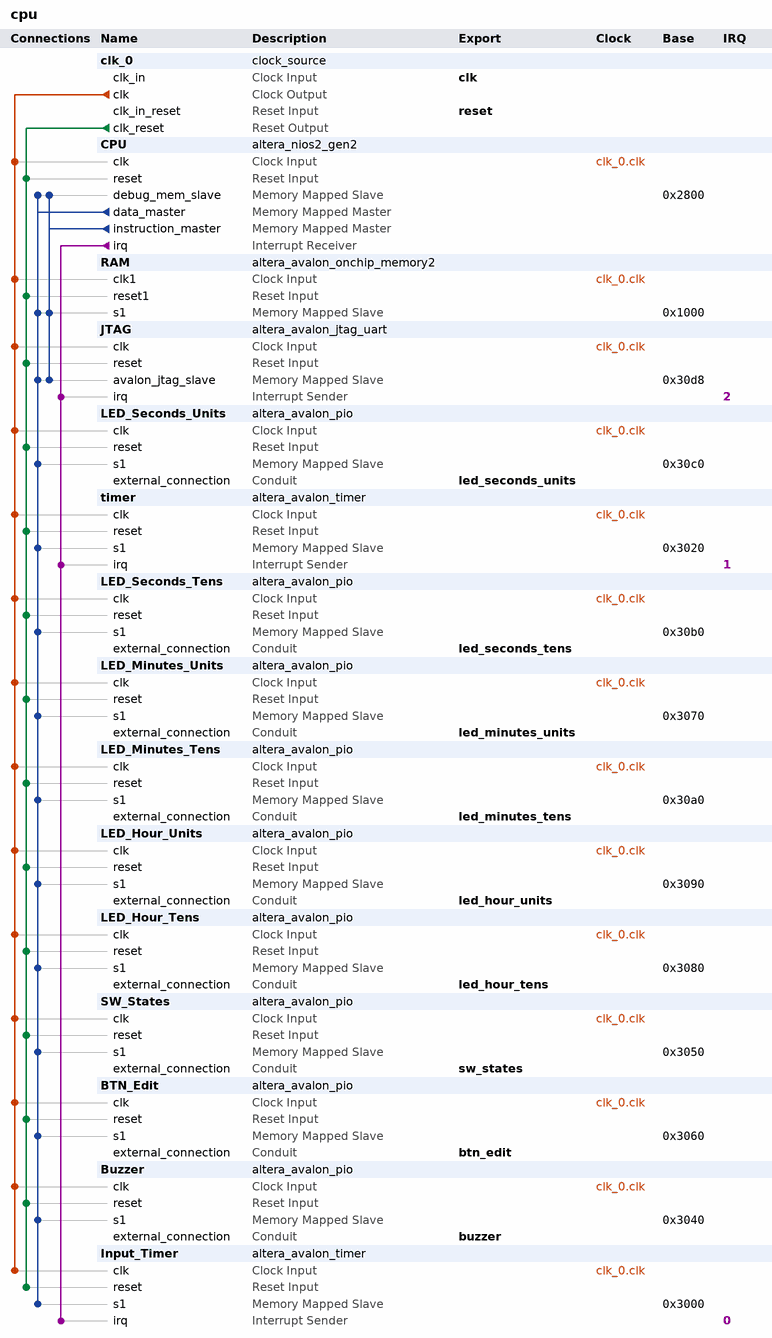
[diagram p0: system contents]
# Platform Designer (Qsys) system cpu, Cyclone V 5CSEMA5F31C6
# Parameters at their usual value, and those the tool derives, are not listed.
package require -exact qsys 18.1
create_system cpu
set_project_property DEVICE_FAMILY {Cyclone V}
set_project_property DEVICE 5CSEMA5F31C6

add_instance clk_0 clock_source 18.1
set_instance_parameter_value clk_0 clockFrequency 50000000

add_instance CPU altera_nios2_gen2 18.1
set_instance_parameter_value CPU dcache_size 2048
set_instance_parameter_value CPU exceptionSlave RAM.s1
set_instance_parameter_value CPU icache_size 4096
set_instance_parameter_value CPU impl Tiny
set_instance_parameter_value CPU resetSlave RAM.s1

add_instance RAM altera_avalon_onchip_memory2 18.1
set_instance_parameter_value RAM dataWidth 32
set_instance_parameter_value RAM dualPort false
set_instance_parameter_value RAM initMemContent true
set_instance_parameter_value RAM initializationFileName onchip_mem.hex
set_instance_parameter_value RAM memorySize 4096

add_instance JTAG altera_avalon_jtag_uart 18.1
set_instance_parameter_value JTAG simInteractiveOptions NO_INTERACTIVE_WINDOWS

add_instance LED_Seconds_Units altera_avalon_pio 18.1
set_instance_parameter_value LED_Seconds_Units direction Output
set_instance_parameter_value LED_Seconds_Units width 7

add_instance timer altera_avalon_timer 18.1
set_instance_parameter_value timer period 1
set_instance_parameter_value timer periodUnits SEC

add_instance LED_Seconds_Tens altera_avalon_pio 18.1
set_instance_parameter_value LED_Seconds_Tens direction Output
set_instance_parameter_value LED_Seconds_Tens width 7

add_instance LED_Minutes_Units altera_avalon_pio 18.1
set_instance_parameter_value LED_Minutes_Units direction Output
set_instance_parameter_value LED_Minutes_Units width 7

add_instance LED_Minutes_Tens altera_avalon_pio 18.1
set_instance_parameter_value LED_Minutes_Tens direction Output
set_instance_parameter_value LED_Minutes_Tens width 7

add_instance LED_Hour_Units altera_avalon_pio 18.1
set_instance_parameter_value LED_Hour_Units direction Output
set_instance_parameter_value LED_Hour_Units width 7

add_instance LED_Hour_Tens altera_avalon_pio 18.1
set_instance_parameter_value LED_Hour_Tens direction Output
set_instance_parameter_value LED_Hour_Tens width 7

add_instance SW_States altera_avalon_pio 18.1
set_instance_parameter_value SW_States direction Input
set_instance_parameter_value SW_States width 3

add_instance BTN_Edit altera_avalon_pio 18.1
set_instance_parameter_value BTN_Edit direction Input
set_instance_parameter_value BTN_Edit width 3

add_instance Buzzer altera_avalon_pio 18.1
set_instance_parameter_value Buzzer direction Output
set_instance_parameter_value Buzzer width 1

add_instance Input_Timer altera_avalon_timer 18.1
set_instance_parameter_value Input_Timer period 200
set_instance_parameter_value Input_Timer periodUnits MSEC

# connections
add_connection clk_0.clk BTN_Edit.clk clock
add_connection clk_0.clk Buzzer.clk clock
add_connection clk_0.clk CPU.clk clock
add_connection clk_0.clk Input_Timer.clk clock
add_connection clk_0.clk JTAG.clk clock
add_connection clk_0.clk LED_Hour_Tens.clk clock
add_connection clk_0.clk LED_Hour_Units.clk clock
add_connection clk_0.clk LED_Minutes_Tens.clk clock
add_connection clk_0.clk LED_Minutes_Units.clk clock
add_connection clk_0.clk LED_Seconds_Tens.clk clock
add_connection clk_0.clk LED_Seconds_Units.clk clock
add_connection clk_0.clk RAM.clk1 clock
add_connection clk_0.clk SW_States.clk clock
add_connection clk_0.clk timer.clk clock
add_connection clk_0.clk_reset BTN_Edit.reset reset
add_connection clk_0.clk_reset Buzzer.reset reset
add_connection clk_0.clk_reset CPU.reset reset
add_connection clk_0.clk_reset Input_Timer.reset reset
add_connection clk_0.clk_reset JTAG.reset reset
add_connection clk_0.clk_reset LED_Hour_Tens.reset reset
add_connection clk_0.clk_reset LED_Hour_Units.reset reset
add_connection clk_0.clk_reset LED_Minutes_Tens.reset reset
add_connection clk_0.clk_reset LED_Minutes_Units.reset reset
add_connection clk_0.clk_reset LED_Seconds_Tens.reset reset
add_connection clk_0.clk_reset LED_Seconds_Units.reset reset
add_connection clk_0.clk_reset RAM.reset1 reset
add_connection clk_0.clk_reset SW_States.reset reset
add_connection clk_0.clk_reset timer.reset reset
add_connection CPU.data_master BTN_Edit.s1 avalon
set_connection_parameter_value CPU.data_master/BTN_Edit.s1 baseAddress 0x3060
add_connection CPU.data_master Buzzer.s1 avalon
set_connection_parameter_value CPU.data_master/Buzzer.s1 baseAddress 0x3040
add_connection CPU.data_master CPU.debug_mem_slave avalon
set_connection_parameter_value CPU.data_master/CPU.debug_mem_slave baseAddress 0x2800
add_connection CPU.data_master Input_Timer.s1 avalon
set_connection_parameter_value CPU.data_master/Input_Timer.s1 baseAddress 0x3000
add_connection CPU.data_master JTAG.avalon_jtag_slave avalon
set_connection_parameter_value CPU.data_master/JTAG.avalon_jtag_slave baseAddress 0x30d8
add_connection CPU.data_master LED_Hour_Tens.s1 avalon
set_connection_parameter_value CPU.data_master/LED_Hour_Tens.s1 baseAddress 0x3080
add_connection CPU.data_master LED_Hour_Units.s1 avalon
set_connection_parameter_value CPU.data_master/LED_Hour_Units.s1 baseAddress 0x3090
add_connection CPU.data_master LED_Minutes_Tens.s1 avalon
set_connection_parameter_value CPU.data_master/LED_Minutes_Tens.s1 baseAddress 0x30a0
add_connection CPU.data_master LED_Minutes_Units.s1 avalon
set_connection_parameter_value CPU.data_master/LED_Minutes_Units.s1 baseAddress 0x3070
add_connection CPU.data_master LED_Seconds_Tens.s1 avalon
set_connection_parameter_value CPU.data_master/LED_Seconds_Tens.s1 baseAddress 0x30b0
add_connection CPU.data_master LED_Seconds_Units.s1 avalon
set_connection_parameter_value CPU.data_master/LED_Seconds_Units.s1 baseAddress 0x30c0
add_connection CPU.data_master RAM.s1 avalon
set_connection_parameter_value CPU.data_master/RAM.s1 baseAddress 0x1000
add_connection CPU.data_master SW_States.s1 avalon
set_connection_parameter_value CPU.data_master/SW_States.s1 baseAddress 0x3050
add_connection CPU.data_master timer.s1 avalon
set_connection_parameter_value CPU.data_master/timer.s1 baseAddress 0x3020
add_connection CPU.instruction_master CPU.debug_mem_slave avalon
set_connection_parameter_value CPU.instruction_master/CPU.debug_mem_slave baseAddress 0x2800
add_connection CPU.instruction_master JTAG.avalon_jtag_slave avalon
set_connection_parameter_value CPU.instruction_master/JTAG.avalon_jtag_slave baseAddress 0x30d8
add_connection CPU.instruction_master RAM.s1 avalon
set_connection_parameter_value CPU.instruction_master/RAM.s1 baseAddress 0x1000
add_connection CPU.irq Input_Timer.irq interrupt
set_connection_parameter_value CPU.irq/Input_Timer.irq irqNumber 0
add_connection CPU.irq JTAG.irq interrupt
set_connection_parameter_value CPU.irq/JTAG.irq irqNumber 2
add_connection CPU.irq timer.irq interrupt
set_connection_parameter_value CPU.irq/timer.irq irqNumber 1

# exported interfaces
add_interface btn_edit conduit end
set_interface_property btn_edit EXPORT_OF BTN_Edit.external_connection
add_interface buzzer conduit end
set_interface_property buzzer EXPORT_OF Buzzer.external_connection
add_interface clk clock sink
set_interface_property clk EXPORT_OF clk_0.clk_in
add_interface led_hour_tens conduit end
set_interface_property led_hour_tens EXPORT_OF LED_Hour_Tens.external_connection
add_interface led_hour_units conduit end
set_interface_property led_hour_units EXPORT_OF LED_Hour_Units.external_connection
add_interface led_minutes_tens conduit end
set_interface_property led_minutes_tens EXPORT_OF LED_Minutes_Tens.external_connection
add_interface led_minutes_units conduit end
set_interface_property led_minutes_units EXPORT_OF LED_Minutes_Units.external_connection
add_interface led_seconds_tens conduit end
set_interface_property led_seconds_tens EXPORT_OF LED_Seconds_Tens.external_connection
add_interface led_seconds_units conduit end
set_interface_property led_seconds_units EXPORT_OF LED_Seconds_Units.external_connection
add_interface reset reset sink
set_interface_property reset EXPORT_OF clk_0.clk_in_reset
add_interface sw_states conduit end
set_interface_property sw_states EXPORT_OF SW_States.external_connection

set_interconnect_requirement {$system} qsys_mm.clockCrossingAdapter HANDSHAKE
set_interconnect_requirement {$system} qsys_mm.enableEccProtection FALSE
set_interconnect_requirement {$system} qsys_mm.insertDefaultSlave FALSE
set_interconnect_requirement {$system} qsys_mm.maxAdditionalLatency 1

save_system cpu.qsys
